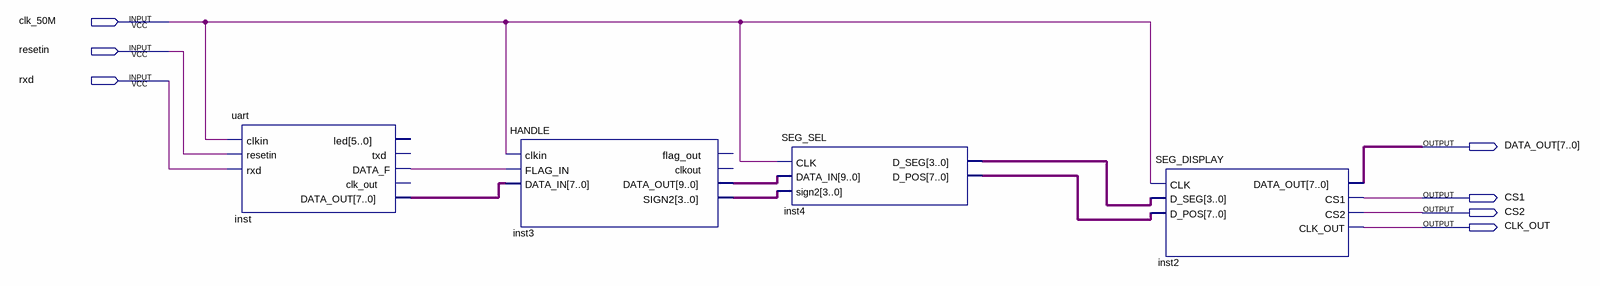
[diagram p0: schematic sheet]
// Quartus schematic competition.bdf as structural Verilog: 4 symbols, 7 pins
module competition (
  input  clk_50M,
  input  resetin,
  input  rxd,
  output [7:0] DATA_OUT,
  output CS1,
  output CS2,
  output CLK_OUT
);

  wire inst_data_f;
  wire [3:0] inst3_sign2, inst4_d_seg;
  wire [7:0] inst4_d_pos, inst_data_out;
  wire [9:0] inst3_data_out;

  uart inst (
    .clkin(clk_50M), .resetin(resetin), .rxd(rxd), .DATA_F(inst_data_f), .DATA_OUT(inst_data_out));  // open: led, txd, clk_out
  HANDLE inst3 (
    .clkin(clk_50M), .FLAG_IN(inst_data_f), .DATA_IN(inst_data_out), .DATA_OUT(inst3_data_out),
    .SIGN2(inst3_sign2));  // open: flag_out, clkout
  SEG_SEL inst4 (
    .CLK(clk_50M), .DATA_IN(inst3_data_out), .sign2(inst3_sign2), .D_SEG(inst4_d_seg), .D_POS(inst4_d_pos));
  SEG_DISPLAY inst2 (
    .CLK(clk_50M), .D_SEG(inst4_d_seg), .D_POS(inst4_d_pos), .DATA_OUT(DATA_OUT), .CS1(CS1), .CS2(CS2),
    .CLK_OUT(CLK_OUT));
endmodule
